# Altium project SENSOR_Board.PrjPcb
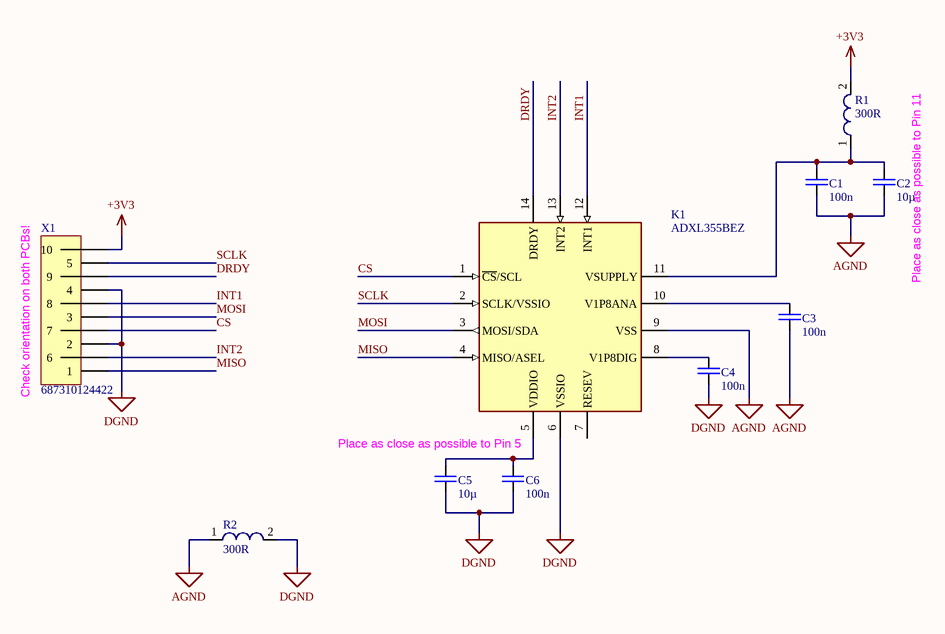
[diagram p0: SENSOR_Board.SchDoc]
1 sheet, 10 parts. Net scope: global (net labels, ports and power ports of the same name join across sheets).
Board file: SENSOR_Board.PcbDoc

## Sheet SENSOR_Board.SchDoc: SENSOR_Board
size A4; Date: 12.04.23; Engineer: Sandurkov; DocumentNumber: 1; Revision: 1; SheetNumber: 1; SheetTotal: 1; Module: SENSOR_Board; Device: AccelSens

### Parts
C1  100n  [CAPC1608X08N]
C2  10µ  [CAPC2012X14N]
C3  100n  [CAPC1608X08N]
C4  100n  [CAPC1608X08N]
C5  10µ  [CAPC2012X14N]
C6  100n  [CAPC1608X08N]
K1  ADXL355BEZ  [FP-E-14-1-MFG]
R1  300R  [0603 (WE-CBF)]
R2  300R  [0603 (WE-CBF)]
X1  687310124422  [687310124422]

### Nets
+3V3: R1.2 X1.10
AGND: C1.2 C2.2 C3.2 K1.9(VSS) R2.1
DGND: C4.2 C5.2 C6.2 K1.6(VSSIO) R2.2 X1.2 X1.4
CS: K1.1(~{CS}/SCL) X1.7
DRDY: K1.14(DRDY) X1.9
INT1: K1.12(INT1) X1.8
INT2: K1.13(INT2) X1.6
MISO: K1.4(MISO/ASEL) X1.1
MOSI: K1.3(MOSI/SDA) X1.3
SCLK: K1.2(SCLK/VSSIO) X1.5
NetC1_1: C1.1 C2.1 K1.11(VSUPPLY) R1.1
NetC3_1: C3.1 K1.10(V1P8ANA)
NetC4_1: C4.1 K1.8(V1P8DIG)
NetC5_1: C5.1 C6.1 K1.5(VDDIO)

Not connected (* = marked no-connect by the designer): K1 7(RESEV)

### Notes on the sheet
- (near C2) Place as close as possible to Pin 11
- (near X1) Check orientation on both PCBs!
- Place as close as possible to Pin 5
- Project
- Module
- Drawn by:
- Approved by:
- Title
- Size:
- Date:
- A4
- Number:
- Revision:
- Sheet
- of
- Munich Institute of Biomed. Eng.
- Technische Universität München
- AG Magnetische Felder
- Boltzmannstrasse 11
- 85748 Garching
- File:

### Library data of the parts
C1 C3 C4 C6 = C0603C104K5RACTU: 100n, 0603, X7R, 10%, 50 V; Manufacturer: Kemet; Voltage Rating: 50 V; Dielectric: X7R; Value: 100n; Tolerance: 10%; ComponentLink1Description: Datasheet; ComponentLink1URL: http://www.farnell.com/datasheets/1851736.pdf; Supplier 1: Digi-Key; Supplier 2: Farnell; Supplier 3: Mouser; Supplier Part Number 1: 399-5089-1-ND; Supplier Part Number 2: 1288255; Supplier Part Number 3: 80-C0603C104K5R
C2 C5 = C0805C106K4PACTU: 10µ, 0805, X5R, 10%, 16 V; Manufacturer: Kemet; Voltage Rating: 16 V; Dielectric: X5R; Value: 10µ; Tolerance: 10%; ComponentLink1Description: Datasheet; ComponentLink1URL: http://www.farnell.com/datasheets/1732713.pdf; Supplier 1: Digi-Key; Supplier 2: Farnell; Supplier 3: Mouser; Supplier Part Number 1: 399-8012-1-ND; Supplier Part Number 2: 1288204; Supplier Part Number 3: 80-C0805C106K4P
K1 = ADXL355BEZ: ACCELEROMETER2-4-8GDIGTL14QFN; Manufacturer: Analog Devices; Output Type: SPI,I2C; Axis: X, Y, Z; Bandwidth: 1.5kHz; Supplier 1: Mouser; Manufacturer Part Number: ADXL355BEZ; RoHS: Yes; Category: Accelerometers; Stock 1: 9178; Pricing 1: 1=64,97, 10=59,06, 50=59,06, 100=59,06, 1000=59,06, 10000=59,06 (USD); Mount: Surface Mount; Case/Package: CLCC; Number of Pins: 14; Min Operating Temperature: -40°C; Max Operating Temperature: 125°C; Series: -; Packaging: Tray; RoHS Compliant: Yes; Lead Free: Contains Lead; ComponentLink1URL: http://www.farnell.com/datasheets/2200405.pdf?src-supplier=Farnell; ComponentLink1Description: http://www.farnell.com/datasheets/2200405.pdf?src-supplier=Farnell; ComponentLink2URL: https://www.analog.com/media/en/technical-documentation/data-sheets/ADXL354_355.pdf?src-supplier=Digi-Key; ComponentLink2Description: https://www.analog.com/media/en/technical-documentation/data-sheets/ADXL354_355.pdf?src-supplier=Digi-Key
R1 R2 = 742792641: 300R / 100 MHz, 2 A, 0R15, WE-CBF; Manufacturer: Wurth Electronics; Core Material: Ferrite; Max Current Rating: 2A; Number of Lines: 1; Test Frequency: 100MHz; Tolerance: 25%; Inductance: 18nH; Supplier 1: Rs; Manufacturer Part Number: 742792641; RoHS: Yes; Category: Ferrite Beads and Chips; Stock 1: 21100; Pricing 1: 500=0,165, 2500=0,149, 5000=0,134, 12500=0,12 (EUR); Mount: Surface Mount; Case/Package: SMD/SMT; Weight: 0.000141oz; Case Code (Metric): 1608; Case Code (Imperial): 0603; Material: Ferrite; Min Operating Temperature: -55°C; Max Operating Temperature: 125°C; Package Quantity: 1; Packaging: Tape and Reel; Impedance: 300R; Max DC Current: 2A; Termination: SMD/SMT; Series: WE-CBF; Current Rating: 2A; Length: 1.6mm; Width: 0.8mm; Height: 0.8mm; Depth: 0.8mm; RoHS Compliant: Yes; Lead Free: Lead Free; Reach SVHC Compliant: Unknown; ComponentLink1URL: https://datasheet.ciiva.com/1466/1705830-1466501.pdf?src-supplier=Element14; ComponentLink1Description: https://datasheet.ciiva.com/1466/1705830-1466501.pdf?src-supplier=Element14; ComponentLink2URL: https://datasheet.ciiva.com/4940/742792641-72209-4940450.pdf?src-supplier=Mouser; ComponentLink2Description: https://datasheet.ciiva.com/4940/742792641-72209-4940450.pdf?src-supplier=Mouser; ComponentLink3URL: https://datasheet.ciiva.com/1013/742792641-1013888.pdf?src-supplier=Digi-Key; ComponentLink3Description: https://datasheet.ciiva.com/1013/742792641-1013888.pdf?src-supplier=Digi-Key; ComponentLink4URL: https://datasheet.ciiva.com/11800/0900766b80d2e072-11800409.pdf?src-supplier=Rs; ComponentLink4Description: https://datasheet.ciiva.com/11800/0900766b80d2e072-11800409.pdf?src-supplier=Rs; ComponentLink5URL: https://datasheet.ciiva.com/1466/1705830-1466502.pdf?src-supplier=Element14; ComponentLink5Description: https://datasheet.ciiva.com/1466/1705830-1466502.pdf?src-supplier=Element14; ComponentLink6URL: https://datasheet.ciiva.com/1013/742792641-1013889.pdf?src-supplier=Digi-Key; ComponentLink6Description: https://datasheet.ciiva.com/1013/742792641-1013889.pdf?src-supplier=Digi-Key
X1 = 687310124422: Ffc / Fpc Board Connector, Vertical, Surface Mount, Receptacle, 10, 0.5 Mm Rohs Compliant: Yes; Manufacturer: Wurth Electronics; Actuator Material: Polymer,Liquid Crystal Polymer; Actuator Color: Black; Current Rating: 500mA; Voltage Rating: 50V; Contact Location: Side; Number of Positions: 10; Insulation Resistance: 100MR; Mating Cycles: 25; Pitch: 0.5mm; Supplier 1: Rs; Manufacturer Part Number: 687310124422; RoHS: Yes; Category: FFC / FPC; Stock 1: 435; Pricing 1: 50=1,608, 250=1,488, 500=1,298, 1250=1,176 (EUR); Mount: Surface Mount; Contact Plating: Tin; Contact Material: Bronze,Tin; Housing Material: Liquid Crystal Polymer; Housing Color: Beige; Min Operating Temperature: -25°C; Max Operating Temperature: 85°C; Number of Rows: 2; Packaging: Tape and Reel; Package Quantity: 1; Termination: Solder; Gender: Receptacle; Number of Contacts: 10; Orientation: Straight; Series: WR-FPC; Length: 11.4mm; Width: 3.5mm; Lead Free: Lead Free; Flammability Rating: UL94 V-0; RoHS Compliant: Yes; Reach SVHC Compliant: Unknown; ComponentLink1URL: https://datasheet.ciiva.com/25617/0900766b81113c2b-25617817.pdf?src-supplier=Rs; ComponentLink1Description: https://datasheet.ciiva.com/25617/0900766b81113c2b-25617817.pdf?src-supplier=Rs; ComponentLink2URL: https://datasheet.ciiva.com/8067/1388844-8067302.pdf?src-supplier=Element14; ComponentLink2Description: https://datasheet.ciiva.com/8067/1388844-8067302.pdf?src-supplier=Element14; ComponentLink3URL: https://datasheet.ciiva.com/670/6873xx124422-670422.pdf?src-supplier=Digi-Key; ComponentLink3Description: https://datasheet.ciiva.com/670/6873xx124422-670422.pdf?src-supplier=Digi-Key; ComponentLink4URL: https://datasheet.ciiva.com/670/6873xx124422-670421.pdf?src-supplier=Digi-Key; ComponentLink4Description: https://datasheet.ciiva.com/670/6873xx124422-670421.pdf?src-supplier=Digi-Key; ComponentLink5URL: https://datasheet.ciiva.com/670/6873xx124422-670423.pdf?src-supplier=Digi-Key; ComponentLink5Description: https://datasheet.ciiva.com/670/6873xx124422-670423.pdf?src-supplier=Digi-Key; ComponentLink6URL: https://datasheet.ciiva.com/29317/709154-da-01-en-smd-zif-stecker-180grad-typ-a-10-pol-29317899.pdf?src-supplier=Conrad; ComponentLink6Description: https://datasheet.ciiva.com/29317/709154-da-01-en-smd-zif-stecker-180grad-typ-a-10-pol-29317899.pdf?src-supplier=Conrad